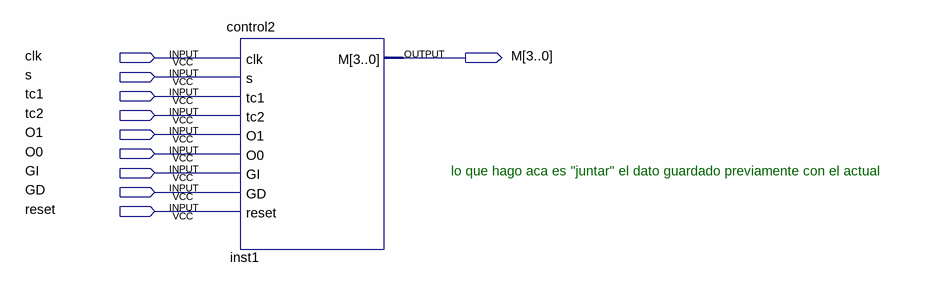
[diagram p0: schematic sheet]
// Quartus schematic actualizacion_paredes.bdf as structural Verilog: 1 symbols, 10 pins
module actualizacion_paredes (
  input  clk,
  input  s,
  input  tc1,
  input  tc2,
  input  O1,
  input  O0,
  input  GI,
  input  GD,
  input  reset,
  output [3:0] M
);

  control2 inst1 (.clk(clk), .s(s), .tc1(tc1), .tc2(tc2), .O1(O1), .O0(O0), .GI(GI), .GD(GD), .reset(reset), .M(M));

  // Notes on the sheet:
  //   lo que hago aca es ''juntar'' el dato guardado previamente con el actual
endmodule
